# Altium schematic sheet Huitzil2.SchDoc
size A4
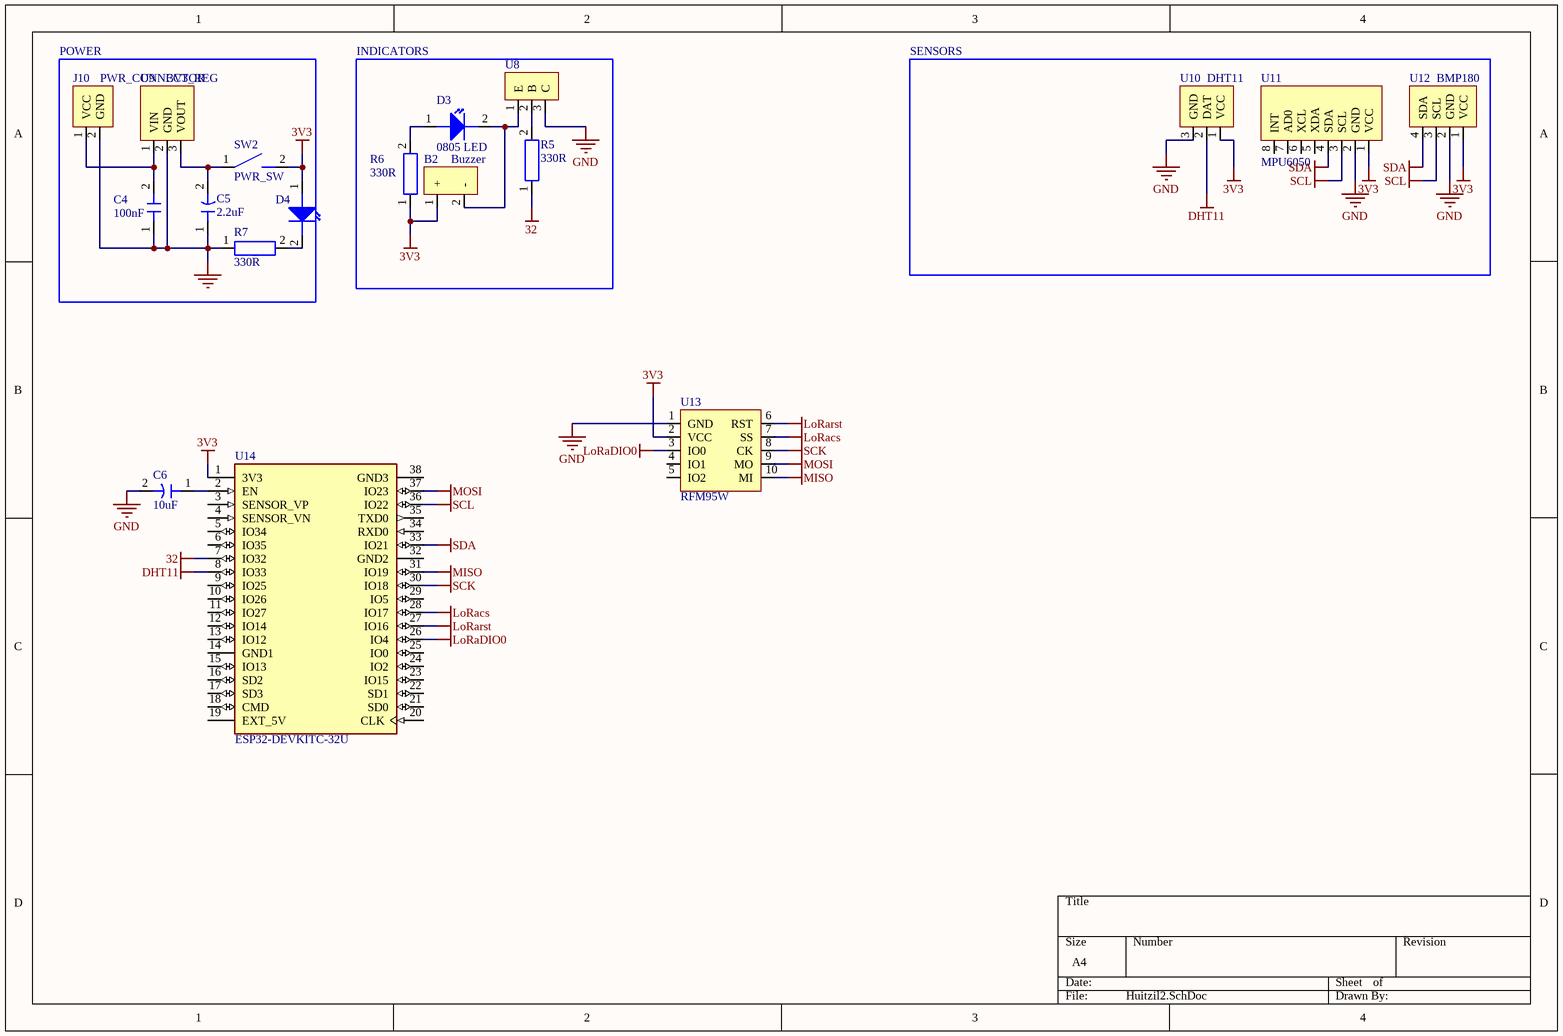
[diagram p0: Huitzil2.SchDoc]

## Parts
B2  Buzzer  [BUZZER]
C4  100nF  [CERAMIC CAP]
C5  2.2uF  [Electrolytic capacitor 2mm]
C6  10uF  [Electrolytic capacitor 2mm]
D3  0805 LED  [3mm_LED]
D4  0805 LED  [3mm_LED]  (value not drawn)
J10  PWR_CONNECTOR  [BATT]
R5  330R  [THT RESISTOR]
R6  330R  [THT RESISTOR]
R7  330R  [THT RESISTOR]
SW2  PWR_SW  [PWR-SW]
U8  NPN Transistor  [2N2222A]  (value not drawn)
U9  3V3_REG  [LF33CV]
U10  DHT11  [DHT11]
U11  MPU6050  [MPU6050]
U12  BMP180  [BMP180]
U13  RFM95W  [Bluee LoRa]
U14  ESP32-DEVKITC-32U  [MODULE_ESP32-DEVKITC-32U]

## Blocks framed on the sheet
POWER: C4 C5 D4 J10 R7 SW2 U9
INDICATORS: B2 D3 R5 R6 U8
SENSORS: U10-U12

## Nets
3V3: B2.1(+) D4.1(A) R6.1 SW2.2(+) U10.1(VCC) U11.1(VCC) U12.1(VCC) U13.2(VCC) U14.1(3V3)
32: R5.1 U14.7(IO32)
DHT11: U10.2(DAT) U14.8(IO33)
GND: C4.1(+) C5.1(+) C6.2(-) J10.2(GND) R7.1 U8.3(C) U9.2(GND) U10.3(GND) U11.2(GND) U12.2(GND) U13.1(GND)
LoRacs: U13.7(SS) U14.28(IO17)
LoRaDIO0: U13.3(IO0) U14.26(IO4)
LoRarst: U13.6(RST) U14.27(IO16)
MISO: U13.10(MI) U14.31(IO19)
MOSI: U13.9(MO) U14.37(IO23)
SCK: U13.8(CK) U14.30(IO18)
SCL: U11.3(SCL) U12.3(SCL) U14.36(IO22)
SDA: U11.4(SDA) U12.4(SDA) U14.33(IO21)
NetB2_2: B2.2(-) D3.2(K) U8.1(E)
NetC4_2: C4.2(-) J10.1(VCC) U9.1(VIN)
NetC5_2: C5.2(-) SW2.1(+) U9.3(VOUT)
NetC6_1: C6.1(+) U14.2(EN)
NetD3_1: D3.1(A) R6.2
NetD4_2: D4.2(K) R7.2
NetR5_2: R5.2 U8.2(B)

Not connected (* = marked no-connect by the designer): U11 5(XDA) 6(XCL) 7(AD0) 8(INT); U13 4(IO1) 5(IO2); U14 3(SENSOR_VP) 4(SENSOR_VN) 5(IO34) 6(IO35) 9(IO25) 10(IO26) 11(IO27) 12(IO14) 13(IO12) 14(GND1) 15(IO13) 16(SD2) 17(SD3) 18(CMD) 19(EXT_5V) 20(CLK) 21(SD0) 22(SD1) 23(IO15) 24(IO2) 25(IO0) 29(IO5) 32(GND2) 34(RXD0) 35(TXD0) 38(GND3)

## Library data of the parts
B2 = BUZZER: Active buzzer
C4 = CAP: Ceramic through-hole capacitor
C5 = E_CAP_2.2uF: Throug-hole 2.2uF
C6 = E_CAP_10uF: Throug-hole 10uF
D3 D4 = LED: Through-hole LED
J10 = PWR-CONN: THT Connector
R5-R7 = Resistor: Through-hole resistor
SW2 = SWITCH: Mechanical through-hole switch
U8 = 2N2222: Through-hole NPN Transistor
U9 = LF33CV: Through-hole 3.3V regulator
U10 = DHT11: Humidity and temperature sensor
U11 = MPU6050: 6DOF IMU sensor
U12 = BMP180: Bosch Pressure Sensor
U13 = RMF95W: 915 MHz LoRa Transceiver
U14 = ESP32-DEVKITC-32U: ESP32-WROOM-32UE series Transceiver; 802.11 b/g/n (Wi-Fi, WiFi, WLAN), BluetoothÂ® Smart Ready 4.x Dual Mode Evaluation Board; MF: Espressif Systems; SnapEDA_Link: https://www.snapeda.com/parts/ESP32-DEVKITC-32U/Espressif+Systems/view-part/?ref=snap; Availability: In Stock; Purchase-URL: https://pricing.snapeda.com/search/part/ESP32-DEVKITC-32U/?ref=eda; Check_prices: https://www.snapeda.com/parts/ESP32-DEVKITC-32U/Espressif+Systems/view-part/?ref=eda; Value: *; Package: None; MP: ESP32-DEVKITC-32U; Price: None